# EasyEDA Pro project Complete_project.epro, schematic Schematic5
Board Name: Seneor; Create Date: 2025-02-22; Page Name: P1; Project Name: 煮茶机; Schematic Name: Schematic5; Update Date: 2025-03-13; Company: 嘉立创EDA; Page Size: A4; Version: V1.0
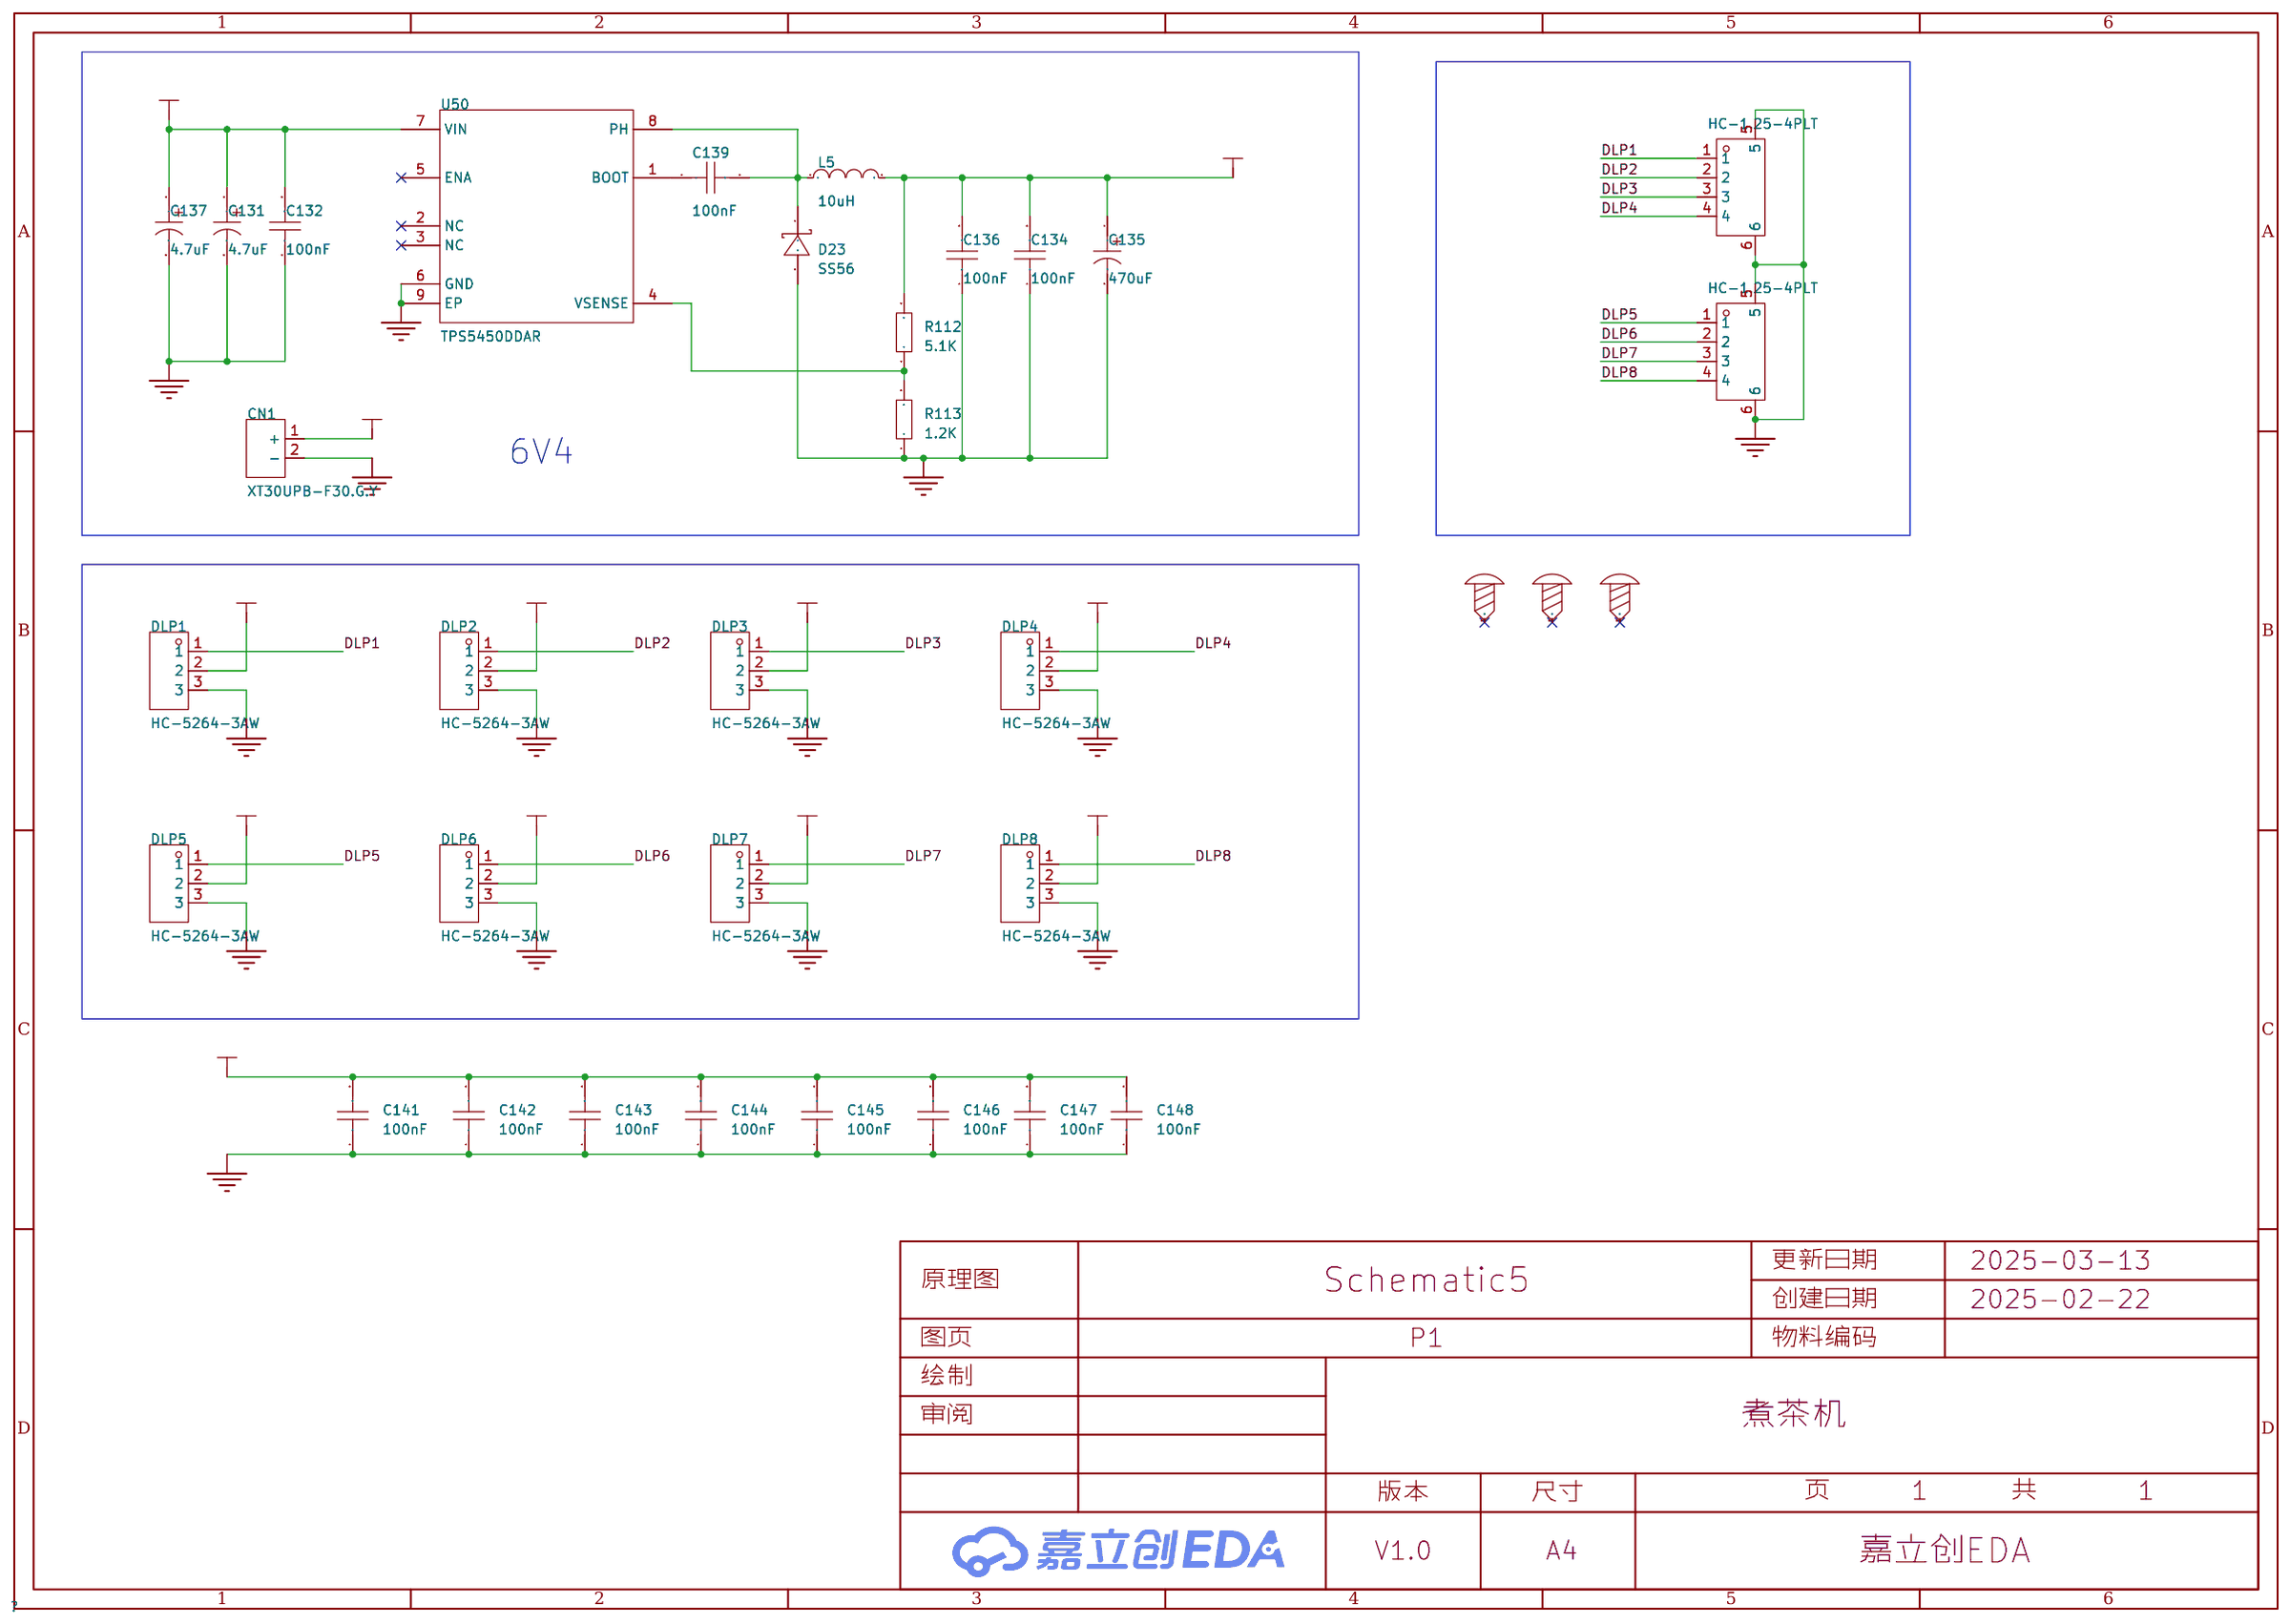
[diagram p8: schematic sheet]

## Parts
C131  4.7uF  [CAP-SMD_BD4.0-L4.3-W4.3-LS5.0-FD]
C132  100nF  [C0805]
C134  100nF  [C0805]
C135  470uF  [CAP-SMD_BD10.0-L10.3-W10.3-LS11.3-FD]
C136  100nF  [C0805]
C137  4.7uF  [CAP-SMD_BD4.0-L4.3-W4.3-LS5.0-FD]
C139  100nF  [C0805]
C141  100nF  [C0805]
C142  100nF  [C0805]
C143  100nF  [C0805]
C144  100nF  [C0805]
C145  100nF  [C0805]
C146  100nF  [C0805]
C147  100nF  [C0805]
C148  100nF  [C0805]
CN1  XT30UPB-F30.G.Y  [CONN-TH_XT30UPB-F]
CN111  HC-1.25-4PLT  [CONN-SMD_4P-P1.25_HCTL_HC-1.25-4PLT]
CN112  HC-1.25-4PLT  [CONN-SMD_4P-P1.25_HCTL_HC-1.25-4PLT]
D23  SS56  [SMA_L4.3-W2.6-LS5.2-RD]
DLP1  HC-5264-3AW  [CONN-TH_3P-P2.50_HCTL_HC-5264-3AW]
DLP2  HC-5264-3AW  [CONN-TH_3P-P2.50_HCTL_HC-5264-3AW]
DLP3  HC-5264-3AW  [CONN-TH_3P-P2.50_HCTL_HC-5264-3AW]
DLP4  HC-5264-3AW  [CONN-TH_3P-P2.50_HCTL_HC-5264-3AW]
DLP5  HC-5264-3AW  [CONN-TH_3P-P2.50_HCTL_HC-5264-3AW]
DLP6  HC-5264-3AW  [CONN-TH_3P-P2.50_HCTL_HC-5264-3AW]
DLP7  HC-5264-3AW  [CONN-TH_3P-P2.50_HCTL_HC-5264-3AW]
DLP8  HC-5264-3AW  [CONN-TH_3P-P2.50_HCTL_HC-5264-3AW]
L5  10uH  [IND-SMD_L7.3-W6.8]
R112  5.1K  [R0805]
R113  1.2K  [R0805]
SCREW1  -  [M2螺丝]
SCREW2  -  [M2螺丝]
SCREW3  -  [M2螺丝]
U50  TPS5450DDAR  [SOP-8_L4.9-W3.9-P1.27-LS6.0-BL-EP]

## Library data of the parts
C131 C137 = VT4.7UF50V167RV0133: 容值:4.7uF;精度:±20%;额定电压:50V;纹波电流:15mA@120Hz;等效串联电阻:-;; LCSC Part Name: 4.7uF ±20% 50V; Supplier Part: C5246584; Manufacturer: KNSCHA(科尼盛); Supplier Footprint: SMD,D4xL5.4mm; JLCPCB Part Class: 扩展库; Datasheet: https://atta.szlcsc.com/upload/public/pdf/source/20221104/28D100275C90741A69E4DC1F6F9A3749.pdf; Supplier: LCSC; Tolerance: ±20%; Rated Voltage: 50V; Ripple Current: 15mA@120Hz; φD: 4mm; L: 5.4mm; Lifetime @ Temp: 2000hrs@105℃; Operating Temperature: -55℃~+105℃
C132 C134 C136 C139 = CAP_0805: Supplier Footprint: 0805
C135 = RVT1E471M1010 470UF 25V: 容值:470uF;精度:±20%;额定电压:25V;纹波电流:286mA@120Hz;等效串联电阻:-;; LCSC Part Name: 470uF ±20% 25V; Supplier Part: C970707; Manufacturer: DMBJ(振宝佳); Supplier Footprint: SMD,D10xL10.2mm; JLCPCB Part Class: Extended Part; Datasheet: https://atta.szlcsc.com/upload/public/pdf/source/20201217/C970594_282EC4D70669AEE33806F6C24A5FAA0B.pdf; Supplier: LCSC; Tolerance: ±20%; Rated Voltage: 25V; Ripple Current: 286mA@120Hz; φD: 10mm; L: 10.2mm; Lifetime @ Temp: 2800hrs@105℃; Operating Temperature: -55℃~+105℃
C141-C148 = CAP_0603: Supplier Footprint: 0603
CN1 = XT30UPB-F30.G.Y: 类别:-;类型1:-;; LCSC Part Name: AMASS(艾迈斯)直立焊板式连接器XT30UPB30-F.G.*; Supplier Part: C108769; Manufacturer: AMASS(艾迈斯); JLCPCB Part Class: 扩展库; Datasheet: https://atta.szlcsc.com/upload/public/pdf/source/20220715/AFD68B9E8B6CA95A7295DBF4AF9325E4.pdf; Supplier: LCSC; Brand: 艾迈斯; Type: 航模插头; Colour: 黄色; RatedVoltage: DC 500V; InterfaceType: 母头; MetalMaterial: 镀金; InsulationMaterial: PA; RatedCurrent: 15A; contact resistance: 0.65mΩ
CN111 CN112 = HC-1.25-4PLT: 插针结构:1x4P;间距:1.25mm;安装方式:立贴;参考系列:-;总PIN数:4P;排数:1;每排PIN数:4;行距:-;额定电流:2A;触头材质:黄铜;触头镀层:锡;工作温度范围:-25℃~+85℃;; LCSC Part Name: 1x4P 间距:1.25mm 立贴; Supplier Part: C2845390; Manufacturer: HCTL(华灿天禄); Supplier Footprint: SMD,P=1.25mm; JLCPCB Part Class: 扩展库; Datasheet: https://atta.szlcsc.com/upload/public/pdf/source/20230707/8E5913B5A3195C18F5EE12EA4CB86B82.pdf; Supplier: LCSC; Pins Structure: 1x4P; Pitch: 1.25mm; Mounting Style: 立贴; Number of Pins: 4P; Number of Rows: 1; Number of PINs Per Row: 4; Current Rating (Max): 2A; Contact Material: 黄铜; Contact Plating: 锡; Operating Temperature Range: -25℃~+85℃
D23 = SS56_C65009: 二极管配置:独立式;正向压降(Vf):700mV@5A;直流反向耐压(Vr):60V;整流电流:5A;; LCSC Part Name: 电压:60V 电流:5A; Supplier Part: C65009; Manufacturer: MDD(辰达半导体); Supplier Footprint: SMA(DO-214AC); JLCPCB Part Class: 扩展库; Datasheet: https://atta.szlcsc.com/upload/public/pdf/source/20230314/529CD85F9B31F69841D3A079BC07E377.pdf; Supplier: LCSC; Diode Configuration: 独立式; Forward Voltage (Vf@If): 700mV@5A; Reverse Voltage (Vr): 60V; Rectified Current: 5A; Reverse Leakage Current (Ir): 1mA@60V
DLP1-DLP8 = HC-5264-3AW: 插针结构:1x3P;间距:2.5mm;安装方式:弯插;参考系列:-;总PIN数:3P;排数:1;每排PIN数:3;行距:-;额定电流:3A;触头材质:黄铜;触头镀层:锡;工作温度范围:-25℃~+85℃;; LCSC Part Name: 1x3P 间距:2.5mm 弯插; Supplier Part: C2845826; Manufacturer: HCTL(华灿天禄); Supplier Footprint: 弯插,P=2.5mm; JLCPCB Part Class: 扩展库; Datasheet: https://atta.szlcsc.com/upload/public/pdf/source/20231019/7C36622803850C43F3C11A8612AA539D.pdf; Supplier: LCSC; Pins Structure: 1x3P; Pitch: 2.5mm; Mounting Style: 弯插; Number of Pins: 3P; Number of Rows: 1; Number of PINs Per Row: 3; Current Rating (Max): 3A; Contact Material: 黄铜; Contact Plating: 锡; Operating Temperature Range: -25℃~+85℃
L5 = FXL0630-100-M: 电感值:10uH;精度:±20%;额定电流:4.5A;饱和电流(Isat):5.5A;类型:一体成型电感;; LCSC Part Name: 10uH ±20% 5.5A; Supplier Part: C167223; Manufacturer: cjiang(长江微电); Supplier Footprint: SMD,6.6x7mm; JLCPCB Part Class: 扩展库; Datasheet: https://atta.szlcsc.com/upload/public/pdf/source/20240426/3189EA8206330E2108542F9E34E540E7.pdf; Supplier: LCSC; Tolerance: ±20%; Rated Current: 4.5A; Saturation Current (Isat): 5.5A; DC Resistance (DCR): 68mΩ; Type: 一体成型电感
R112 R113 = Res_0805: Supplier Footprint: 0805
SCREW1-SCREW3 = M2螺丝: Supplier Footprint: 插件
U50 = TPS5450DDAR: 功能类型:降压型;输出类型:可调;输入电压:5.5V~36V;输出电压:1.221V~31.32V;输出电流(最大值):5A;; Supplier Part: C114425; Manufacturer: TI(德州仪器); Supplier Footprint: SOP-8-EP-150mil; JLCPCB Part Class: 扩展库; Datasheet: https://www.ti.com/cn/lit/gpn/tps5450; Supplier: LCSC; Function: 降压型; Output Type: 可调; Input Voltage: 5.5V~36V; Output Voltage: 1.221V~31.32V; Output Current (Max): 5A; Switching Frequency: 500kHz; Operating Temperature: -40℃~+125℃@(TJ); Synchronous Rectification: 否; Number of Outputs: 1; Topology: 降压式; Switch tube (built-in/external): 内置

## Nets
+6V4: C134.2 C135.1 C136.2 C141.2 C142.2 C143.2 C144.2 C145.2 C146.2 C147.2 C148.2 DLP1.2 DLP2.2 DLP3.2 DLP4.2 DLP5.2 DLP6.2 DLP7.2 DLP8.2 L5.2 R112.2
+12V: C131.1 C132.2 C137.1 CN1.1(+) U50.7(VIN)
GND: C131.2 C132.1 C134.1 C135.2 C136.1 C137.2 C141.1 C142.1 C143.1 C144.1 C145.1 C146.1 C147.1 C148.1 CN1.2(-) CN111.5 CN111.6 CN112.5 CN112.6 D23.2(A) DLP1.3 DLP2.3 DLP3.3 DLP4.3 DLP5.3 DLP6.3 DLP7.3 DLP8.3 R113.1 U50.6(GND) U50.9(EP)
DLP1: CN111.1 DLP1.1
DLP2: CN111.2 DLP2.1
DLP3: CN111.3 DLP3.1
DLP4: CN111.4 DLP4.1
DLP5: CN112.1 DLP5.1
DLP6: CN112.2 DLP6.1
DLP7: CN112.3 DLP7.1
DLP8: CN112.4 DLP8.1
$1N574: R112.1 R113.2 U50.4(VSENSE)
$1N578: C139.2 D23.1(K) L5.1 U50.8(PH)
$1N579: C139.1 U50.1(BOOT)

Not connected (* = marked no-connect by the designer): SCREW1 1*; SCREW2 1*; SCREW3 1*; U50 2(NC)* 3(NC)* 5(ENA)*

## Notes on the sheet
- 6V4
